# Altium schematic sheet DCDC_ST1S10_3V3.SchDoc
size A4
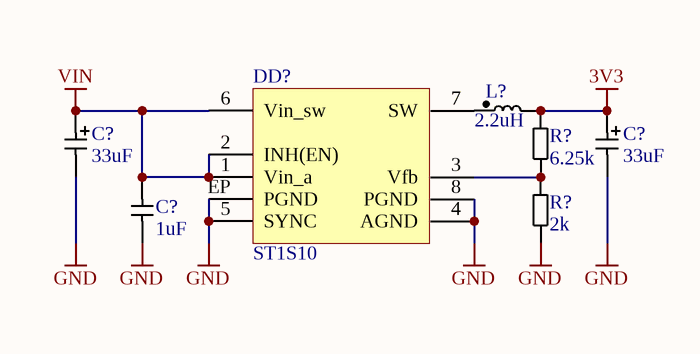
[diagram p0: DCDC_ST1S10_3V3.SchDoc]

## Parts
(Parts that share a designator on the sheet are numbered #1, #2 ... from top to bottom, then left to right.)
C?#1  33uF  [C_EL_6.3]
C?#2  33uF  [C_EL_6.3]
C?#3  1uF  [C0603]
DD?  ST1S10  [SO-8EP]
L?  2.2uH  [SDR0403]
R?#1  6.25k  [R0603]
R?#2  2k  [R0603]

## Nets
3V3: C?#2.1 L?.2 R?#1.2
GND: C?#1.2 C?#2.2 C?#3.2 DD?.4(AGND) DD?.5(SYNC) DD?.8(PGND) DD?.EP(PGND) R?#2.1
VIN: C?#1.1 C?#3.1 DD?.1(Vin_a) DD?.2(INH(EN)) DD?.6(Vin_sw)
NetDD?_3: DD?.3(Vfb) R?#1.1 R?#2.2
NetDD?_7: DD?.7(SW) L?.1

## Library data of the parts
C?#1 C?#2 = CP: Capacitor polarized
C?#3 = C: Capacitor
DD? = ST1S10: ST DC-DC Converter
L? = L: Inductor
R?#1 R?#2 = R: Resistor